# Altium schematic sheet 总电路图2.SchDoc
size A3; Organization: Altium Limited; Address1: L3, 12a Rodborough Rd; Address2: Frenchs Forest; Address3: NSW; Address4: Australia 2086
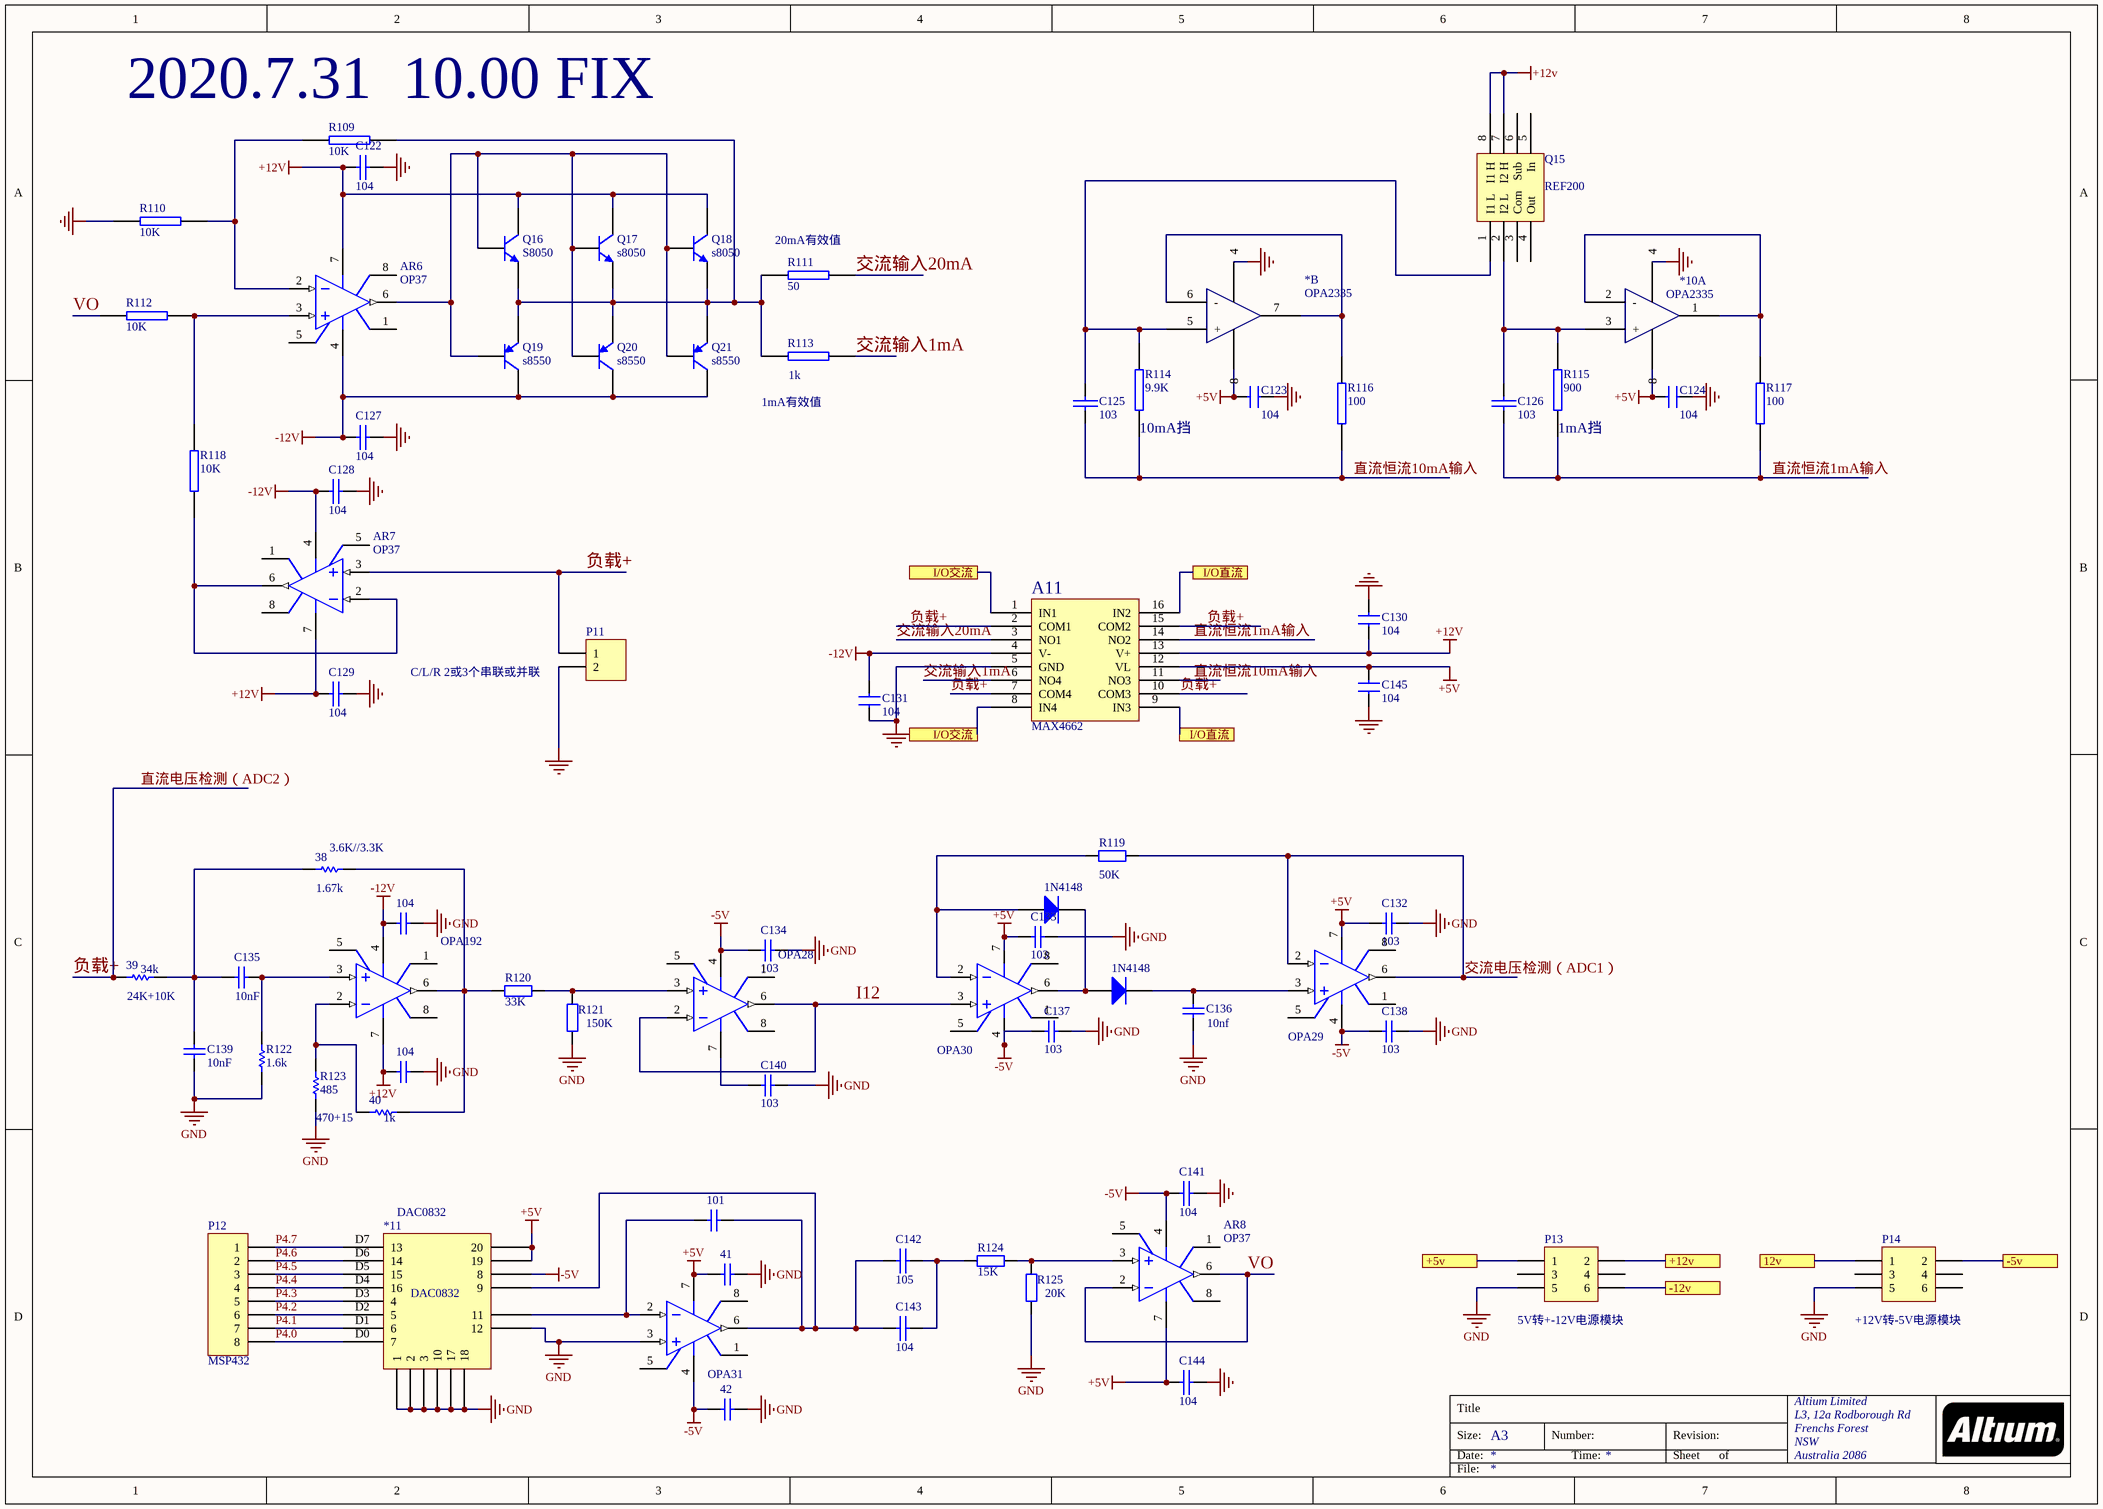
[diagram p0: 总电路图2.SchDoc]

## Parts
(Parts that share a designator on the sheet are numbered #1, #2 ... from top to bottom, then left to right.)
1N4148#1  Diode 1N4001  [DO-41]  (value not drawn)
1N4148#2  Diode 1N4001  [DO-41]  (value not drawn)
38  value 1.67k  [AXIAL-0.3]  (hidden comment: Res1)
39  value 34k  [AXIAL-0.3]  (hidden comment: Res1)
40  value 1k  [AXIAL-0.3]  (hidden comment: Res1)
41  Cap  [RAD-0.3]  (value not drawn)
42  Cap  [RAD-0.3]  (value not drawn)
101  Cap  [RAD-0.3]  (value not drawn)
104#1  Cap  [RAD-0.3]  (value not drawn)
104#2  Cap  [RAD-0.3]  (value not drawn)
*  OPA2335  (part B of 2)
*10  OPA2335  (part A of 2)
*11  DAC0832
A11  MAX4662
AR6  OP37  [H-08A]
AR7  OP37  [H-08A]
AR8  OP37  [H-08A]
C122  104
C123  104  [RAD0.1]
C124  104  [RAD0.1]
C125  103
C126  103
C127  104
C128  104
C129  104
C130  104  [RAD0.1]
C131  104  [RAD0.1]
C132  value 103  [RAD-0.3]  (hidden comment: Cap)
C133  value 103  [RAD-0.3]  (hidden comment: Cap)
C134  value 103  [RAD-0.3]  (hidden comment: Cap)
C135  value 10nF  [RAD-0.3]  (hidden comment: Cap)
C136  value 10nf  [RAD-0.3]  (hidden comment: Cap)
C137  value 103  [RAD-0.3]  (hidden comment: Cap)
C138  value 103  [RAD-0.3]  (hidden comment: Cap)
C139  value 10nF  [RAD-0.3]  (hidden comment: Cap)
C140  value 103  [RAD-0.3]  (hidden comment: Cap)
C141  104
C142  105
C143  104
C144  104
C145  104  [RAD0.1]
OPA28  Op Amp  [H-08A]  (value not drawn)
OPA29  Op Amp  [H-08A]  (value not drawn)
OPA30  Op Amp  [H-08A]  (value not drawn)
OPA31  Op Amp  [H-08A]  (value not drawn)
OPA192  Op Amp  [H-08A]  (value not drawn)
P11  C/L/R 2或3个串联或并联  [HDR1X2H]
P12  MSP432  [HDR1X8]
P13  5V转+-12V电源模块  [HDR2X3]
P14  +12V转-5V电源模块  [HDR2X3]
Q15  REF200
Q16  S8050  [TO-92A]
Q17  s8050  [TO-92A]
Q18  s8050  [TO-92A]
Q19  s8550  [TO-92A]
Q20  s8550  [TO-92A]
Q21  s8550  [TO-92A]
R109  10K
R110  10K
R111  50
R112  10K
R113  1k  [AXIAL0.3]
R114  9.9K
R115  900
R116  100
R117  100
R118  10K
R119  value 50K  [AXIAL-0.4]  (hidden comment: Res2)
R120  value 33K  [AXIAL-0.4]  (hidden comment: Res2)
R121  value 150K  [AXIAL-0.4]  (hidden comment: Res2)
R122  value 1.6k  [AXIAL-0.3]  (hidden comment: Res1)
R123  value 485  [AXIAL-0.3]  (hidden comment: Res1)
R124  value 15K  [AXIAL-0.4]  (hidden comment: Res2)
R125  value 20K  [AXIAL-0.4]  (hidden comment: Res2)

## Ports
12v, +5v, +12v, -5v, -12v, I/O交流, I/O直流

## Nets
+5V: 41.1 *11.D14(20) *11.D15(19) A11.12(VL) AR8.7(V+) C123.1 C124.1 C132.2 C133.2 C144.1 C145.1 OPA29.7(V+) OPA30.7(V+) OPA31.7(V+)
+12V: 104#2.1 A11.13(V+) AR6.7(V+) AR7.7(V+) C122.1 C129.1 C130.1 OPA192.7(V+) Q15.7(I2_H) Q15.8(I1_H) Q16.3(C) Q17.3(C) Q18.3(C)
-5V: 42.1 *11.D16(8) AR8.4(V-) C134.2 C137.2 C138.2 C141.1 OPA28.4(V-) OPA29.4(V-) OPA30.4(V-) OPA31.4(V-)
-12V: 104#1.1 A11.4(V-) AR6.4(V-) AR7.4(V-) C127.1 C128.1 C131.2 OPA192.4(V-) Q19.3(C) Q20.3(C) Q21.3(C)
GND: 41.2 42.2 104#1.2 104#2.2 *11.D8(1) *11.D9(2) *11.D10(3) *11.D11(10) *11.D12(17) *11.D13(18) *11.D19(12) A11.5(GND) C122.2 C123.2 C124.2 C127.2 C128.2 C129.2 C130.2 C131.1 C132.1 C133.1 C134.1 C136.2 C137.1 C138.1 C139.1 C140.1 C141.2 C144.2 C145.2 OPA31.3(IN+) P13.5 P14.5 R110.2 R121.2 R122.1 R123.1 R125.1
12v: P14.1 ; port 12v
+5v: P13.1 ; port +5v  [a separate net that carries the same name]
+12v: P13.2 ; port +12v  [a separate net that carries the same name]
-5v: P14.2 ; port -5v  [a separate net that carries the same name]
-12v: P13.6 ; port -12v  [a separate net that carries the same name]
I12: OPA28.2(IN-) OPA28.6(OUT) OPA30.3(IN+)
I/O交流: A11.1(IN1) A11.8(IN4) ; port I/O交流
I/O直流: A11.9(IN3) A11.16(IN2) ; port I/O直流
P4.0: *11.D0(7) P12.8
P4.1: *11.D1(6) P12.7
P4.2: *11.D2(5) P12.6
P4.3: *11.D3(4) P12.5
P4.4: *11.D4(16) P12.4
P4.5: *11.D5(15) P12.3
P4.6: *11.D6(14) P12.2
P4.7: *11.D7(13) P12.1
VO: AR8.2(IN-) AR8.6(OUT) R112.1
交流电压检测（ADC1）: OPA29.2(IN-) OPA29.6(OUT) R119.2
交流输入1mA: A11.6(NO4) R113.1
交流输入20mA: A11.3(NO1) R111.2
直流恒流1mA输入: A11.14(NO2) C126.1 R115.1 R117.1
直流恒流10mA输入: A11.11(NO3) C125.1 R114.1 R116.1
直流电压检测（ADC2）: 39.1 A11.2(COM1) A11.7(COM4) A11.10(COM3) A11.15(COM2) AR7.3(IN+) P11.1  [also labelled 负载+]
Net1N4148#1_1: 1N4148#1.1(A) OPA30.2(IN-) R119.1
Net1N4148#1_2: 1N4148#1.2(K) 1N4148#2.1(A) OPA30.6(OUT)
Net1N4148#2_2: 1N4148#2.2(K) C136.1 OPA29.3(IN+)
Net38_1: 38.1 39.2 C135.1 C139.2
Net38_2: 38.2 40.2 OPA192.6(OUT) R120.1
Net40_1: 40.1 OPA192.2(IN-) R123.2
Net101_1: 101.1 *11.D18(11) OPA31.2(IN-)
Net101_2: 101.2 *11.D17(9) C142.2 C143.2 OPA31.6(OUT)
Net*10_1: *10.1 *10.2(-) R117.2
Net*10_3: *10.3(+) C126.2 Q15.2(I2_L) R115.2
Net*_5: *.5(+) C125.2 Q15.1(I1_L) R114.2
Net*_6: *.6(-) *.7 R116.2
NetAR6_2: AR6.2(IN-) R109.1 R110.1
NetAR6_3: AR6.3(IN+) R112.2 R118.1
NetAR6_6: AR6.6(OUT) Q16.2(B) Q17.2(B) Q18.2(B) Q19.2(B) Q20.2(B) Q21.2(B)
NetAR7_2: AR7.2(IN-) AR7.6(OUT) R118.2
NetAR8_3: AR8.3(IN+) R124.1 R125.2
NetC135_2: C135.2 OPA192.3(IN+) R122.2
NetC140_2: C140.2 OPA28.7(V+)
NetC142_1: C142.1 C143.1 R124.2
NetOPA28_3: OPA28.3(IN+) R120.2 R121.1
NetQ16_1: Q16.1(E) Q17.1(E) Q18.1(E) Q19.1(E) Q20.1(E) Q21.1(E) R109.2 R111.1 R113.2

Not connected (* = marked no-connect by the designer): * ?1(4) ?2(8); *10 ?1(4) ?2(8); AR6 1(OS_NUL) 5(OS_NUL) 8(TAB); AR7 1(OS_NUL) 5(OS_NUL) 8(TAB); AR8 1(OS_NUL) 5(OS_NUL) 8(TAB); OPA28 1(OS_NUL) 5(OS_NUL) 8(TAB); OPA29 1(OS_NUL) 5(OS_NUL) 8(TAB); OPA30 1(OS_NUL) 5(OS_NUL) 8(TAB); OPA31 1(OS_NUL) 5(OS_NUL) 8(TAB); OPA192 1(OS_NUL) 5(OS_NUL) 8(TAB); P11 2; P13 3 4; P14 3 4 6; Q15 3(Com) 4(Out) 5(In) 6(Sub)

## Notes on the sheet
- (near R109) 2020.7.31  10.00 FIX
- (near R111) 20mA有效值
- 1mA有效值
- (near R114) 10mA挡
- (near R115) 1mA挡
- (near 38) 3.6K//3.3K
- (near 39) 24K+10K
- 470+15
- Title
- Size:
- Date:
- A3
- Number:
- Time:
- Revision:
- Sheet
- of
- File:

## Library data of the parts
1N4148#1 1N4148#2 = Diode 1N4001: 1 Amp General Purpose Rectifier; Published: 8-Jun-2000; LatestRevisionDate: 17-Jul-2002; LatestRevisionNote: Re-released for DXP Platform.; DatasheetVersion: 1998; PackageVersion: Aug-1999; PackageReference: DO-41; Publisher: Altium Limited; PackageDescription: Diode, Axial; Body 5.2 x 2.7 mm (LxDia. max), Lead Dia. 0.86 mm (max); Code_JEDEC: DO-204-AL; ComponentLink1Description: Manufacturer Link; ComponentLink1URL: http://www.fairchildsemi.com/; ComponentLink2Description: Datasheet; ComponentLink2URL: http://www.fairchildsemi.com/ds/1N%2F1N4001.pdf
38-40 R122 R123 = Res1: Resistor; Published: 8-Jun-2000; LatestRevisionDate: 17-Jul-2002; LatestRevisionNote: Re-released for DXP Platform.; PackageReference: AXIAL-0.3; Publisher: Altium Limited; PackageDescription: Axial Device, Thru-Hole; 2 Leads; 0.3 in Pin Spacing
41 42 101 104#1 104#2 = Cap: Capacitor; Value: 100pF; Published: 8-Jun-2000; LatestRevisionDate: 17-Jul-2002; LatestRevisionNote: Re-released for DXP Platform.; PackageReference: RAD-0.3; Publisher: Altium Limited; PackageDescription: Radial Cap, Thru-Hole; 2 Leads; 0.3 in Pin Spacing
*11 Q15 = Component_1
A11 = MAX2662
AR6-AR8 OPA28-OPA31 OPA192 = Op Amp: FET Operational Amplifier; Published: 8-Jun-2000; LatestRevisionDate: 17-Jul-2002; LatestRevisionNote: Re-released for DXP Platform.; DatasheetVersion: REV. B; PackageVersion: 1990; PackageReference: H-08A; Publisher: Altium Limited; PackageDescription: Can; 8 Leads; Pin Circle Dia. 5.08 mm; Lead Dia. 0.53 mm (max); ComponentLink1Description: Manufacturer Link; ComponentLink1URL: http://www.analog.com/
C122-C131 C141-C145 = CAP: Capacitor
  C123 C124 C130 C131 C145: Value: 104
C132-C140 = Cap: Capacitor; Published: 8-Jun-2000; LatestRevisionDate: 17-Jul-2002; LatestRevisionNote: Re-released for DXP Platform.; PackageReference: RAD-0.3; Publisher: Altium Limited; PackageDescription: Radial Cap, Thru-Hole; 2 Leads; 0.3 in Pin Spacing
P11 = Header 2H: Header, 2-Pin, Right Angle; LatestRevisionDate: 17-Jul-2002; LatestRevisionNote: Re-released for DXP Platform.; Publisher: Altium Limited
P12 = Header 8: Header, 8-Pin; LatestRevisionDate: 17-Jul-2002; LatestRevisionNote: Re-released for DXP Platform.; Publisher: Altium Limited
P13 P14 = Header 3X2: Header, 3-Pin, Dual row; LatestRevisionDate: 17-Jul-2002; LatestRevisionNote: Re-released for DXP Platform.; Publisher: Altium Limited
Q16-Q18 = 2N3904: NPN General Purpose Amplifier; Published: 8-Jun-2000; LatestRevisionDate: 15-Jan-2003; LatestRevisionNote: PCB Footprint 'BCY-W3/D4.7' replaced; DatasheetVersion: 1997; PackageVersion: Sep-1998; PackageReference: TO-92A; Publisher: Altium Limited; PackageDescription: TO, Flat Index; 3 In-Line, Axial Leads; Body Dia. 4.5mm; Leads 0.51 x 0.48 mm (max); ComponentLink1Description: Manufacturer Link; ComponentLink1URL: http://www.fairchildsemi.com/; ComponentLink2Description: Datasheet; ComponentLink2URL: http://www.fairchildsemi.com/ds/2N%2F2N3904.pdf
Q19-Q21 = 2N3906: PNP General Purpose Amplifier; Published: 8-Jun-2000; LatestRevisionDate: 15-Jan-2003; LatestRevisionNote: PCB Footprint 'BCY-W3/D4.7' replaced; DatasheetVersion: 1997; PackageVersion: Sep-1998; PackageReference: TO-92A; Publisher: Altium Limited; PackageDescription: TO, Flat Index; 3 In-Line, Axial Leads; Body Dia. 4.5mm; Leads 0.51 x 0.48 mm (max); ComponentLink1Description: Manufacturer Link; ComponentLink1URL: http://www.fairchildsemi.com/; ComponentLink2Description: Datasheet; ComponentLink2URL: http://www.fairchildsemi.com/ds/2N%2F2N3906.pdf
R109-R118 = RES2
R119-R121 R124 R125 = Res2: Resistor; Published: 8-Jun-2000; LatestRevisionDate: 17-Jul-2002; LatestRevisionNote: Re-released for DXP Platform.; PackageReference: AXIAL-0.4; Publisher: Altium Limited; PackageDescription: Axial Device, Thru-Hole; 2 Leads; 0.4 in Pin Spacing